# Altium schematic sheet power.SchDoc
size A4
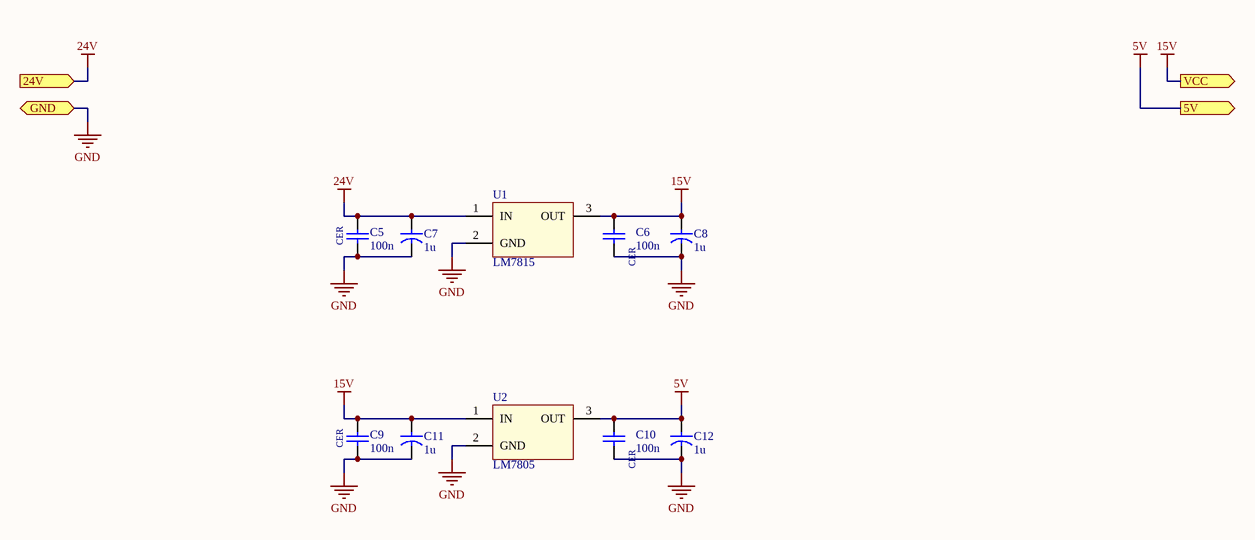
[diagram p0: power.SchDoc]

## Parts
C5  100n  [CAP_CER_2.50]
C6  100n  [CAP_CER_2.50]
C7  1u  [CAP_ELEC_2.50]
C8  1u  [CAP_ELEC_2.50]
C9  100n  [CAP_CER_2.50]
C10  100n  [CAP_CER_2.50]
C11  1u  [CAP_ELEC_2.50]
C12  1u  [CAP_ELEC_2.50]
U1  LM7815  [ONSC-TO-220-3-221A-09]
U2  LM7805  [ONSC-TO-220-3-221A-09]

## Ports
5V (out), 24V (in), GND (bidir), VCC (out)

## Nets
5V: C10.2 C12.1 U2.3(OUT) ; port 5V
15V: C6.2 C8.1 C9.2 C11.1 U1.3(OUT) U2.1(IN) ; port VCC
24V: C5.2 C7.1 U1.1(IN) ; port 24V
GND: C5.1 C6.1 C7.2 C8.2 C9.1 C10.1 C11.2 C12.2 U1.2(GND) U2.2(GND) ; port GND

## Notes on the sheet
- (in symbol CAP_CER) CER

## Library data of the parts
C5 C6 C9 C10 = CAP_CER: Value: F
C7 C8 C11 C12 = CAP_ELEC: Value: F
U1 = LM7815: ComponentLink1Description: Manufacturer URL; ComponentLink1URL: http://www.onsemi.com/; ComponentLink2Description: Datasheet; ComponentLink2URL: http://www.onsemi.com/pub_link/Collateral/NTD5862N-D.PDF; ComponentLink3Description: Package Specification; ComponentLink3URL: http://www.onsemi.com/pub_link/Collateral/221A-09.PDF
U2 = LM7805: ComponentLink1Description: Manufacturer URL; ComponentLink1URL: http://www.onsemi.com/; ComponentLink2Description: Datasheet; ComponentLink2URL: http://www.onsemi.com/pub_link/Collateral/NTD5862N-D.PDF; ComponentLink3Description: Package Specification; ComponentLink3URL: http://www.onsemi.com/pub_link/Collateral/221A-09.PDF